# Altium schematic sheet [1]-Controller_Page.SchDoc: STM Bluepill
size A; DrawnBy: Aviral Mishra; DocumentNumber: 1; Revision: V1.0; SheetNumber: 1; SheetTotal: 2; Company Name: Esteem PCB
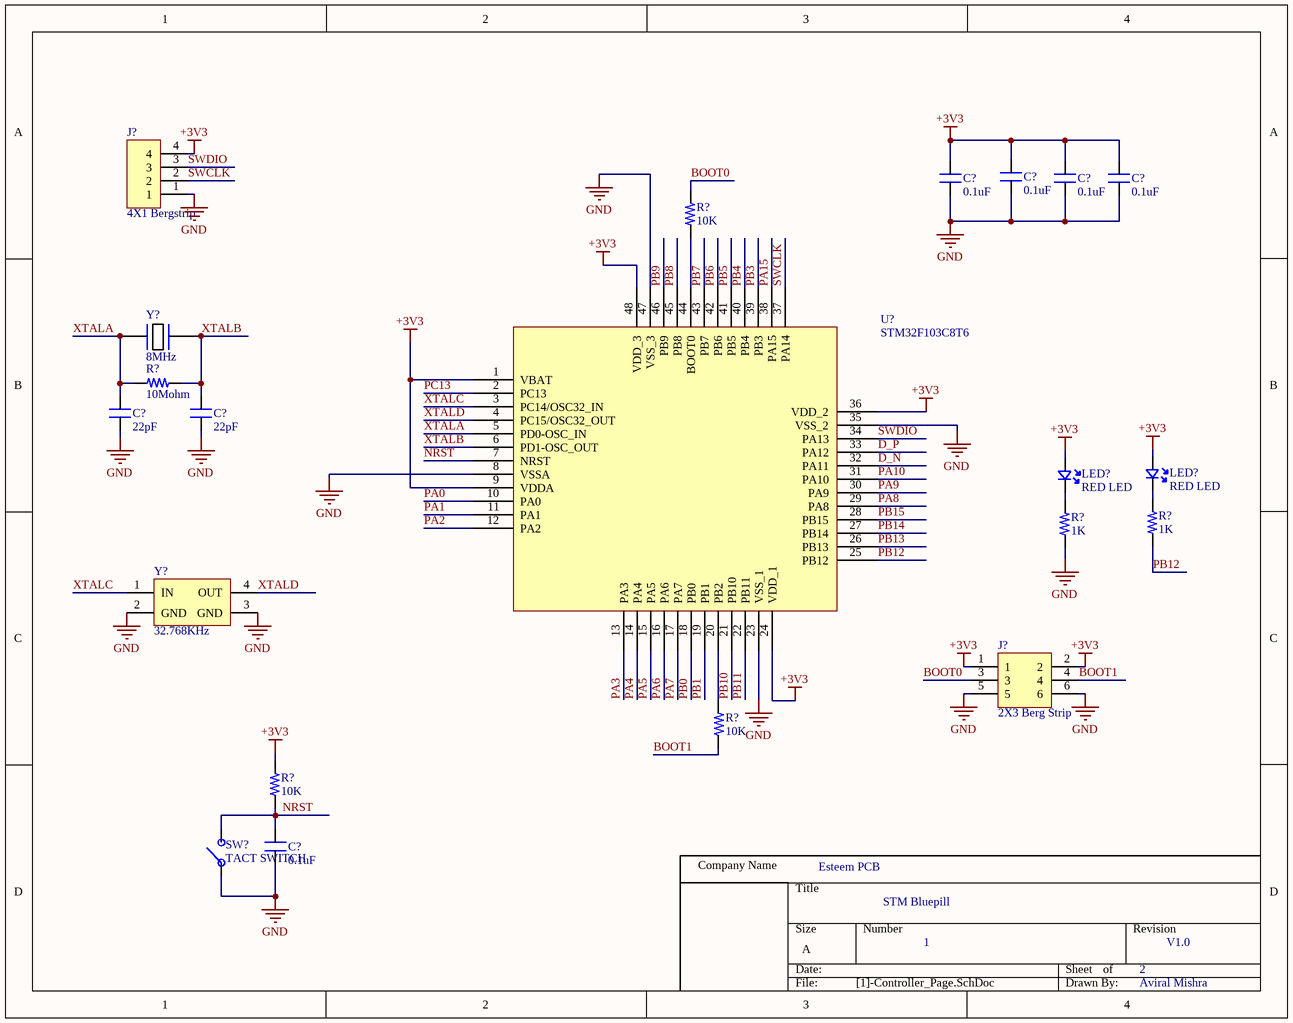
[diagram p0: [1]-Controller_Page.SchDoc]

## Parts
(Parts that share a designator on the sheet are numbered #1, #2 ... from top to bottom, then left to right.)
C?#1  0.1uF  [CAP_0805]
C?#2  0.1uF  [CAP_0805]
C?#3  0.1uF  [CAP_0805]
C?#4  0.1uF  [CAP_0805]
C?#5  22pF  [CAP_0805]
C?#6  22pF  [CAP_0805]
C?#7  0.1uF  [CAP_0805]
J?#1  4X1 Bergstrip  [CON4_100_40D72_TH_ST_MALE]
J?#2  2X3 Berg Strip  [CON6_100_59D78_TH_ST_Duplicate]
LED?#1  RED LED  [LED_0805]
LED?#2  RED LED  [LED_0805]
R?#1  10K  [RES_0805]
R?#2  10Mohm  [RES_0805]
R?#3  1K  [RES_0805]
R?#4  1K  [RES_0805]
R?#5  10K  [RES_0805]
R?#6  10K  [RES_0805]
SW?  TACT SWITCH  [SW_342_SMD]
U?  STM32F103C8T6  [LQFP-48_19.6_393_58X11_SMD]
Y?#1  8MHz  [XTAL_314_240X47_SMD]
Y?#2  32.768KHz  [XTAL_MC-405 32.7680K-G3]

## Nets
+3V3: C?#1.2 C?#2.2 C?#3.2 C?#4.2 J?#1.4 J?#2.1 J?#2.2 LED?#1.A LED?#2.A R?#6.2 U?.1(VBAT) U?.9(VDDA) U?.24(VDD_1) U?.36(VDD_2) U?.48(VDD_3)
GND: C?#1.1 C?#2.1 C?#3.1 C?#4.1 C?#5.1 C?#6.1 C?#7.1 J?#1.1 J?#2.5 J?#2.6 R?#3.1 SW?.1 U?.8(VSSA) U?.23(VSS_1) U?.35(VSS_2) U?.47(VSS_3) Y?#2.2(GND) Y?#2.3(GND)
BOOT0: J?#2.3 R?#1.2
BOOT1: J?#2.4 R?#5.2
D_N: U?.32(PA11)
D_P: U?.33(PA12)
NRST: C?#7.2 R?#6.1 SW?.2 U?.7(NRST)
PA0: U?.10(PA0)
PA1: U?.11(PA1)
PA2: U?.12(PA2)
PA3: U?.13(PA3)
PA4: U?.14(PA4)
PA5: U?.15(PA5)
PA6: U?.16(PA6)
PA7: U?.17(PA7)
PA8: U?.29(PA8)
PA9: U?.30(PA9)
PA10: U?.31(PA10)
PA15: U?.38(PA15)
PB0: U?.18(PB0)
PB1: U?.19(PB1)
PB3: U?.39(PB3)
PB4: U?.40(PB4)
PB5: U?.41(PB5)
PB6: U?.42(PB6)
PB7: U?.43(PB7)
PB8: U?.45(PB8)
PB9: U?.46(PB9)
PB10: U?.21(PB10)
PB11: U?.22(PB11)
PB12: R?#4.1 U?.25(PB12)
PB13: U?.26(PB13)
PB14: U?.27(PB14)
PB15: U?.28(PB15)
PC13: U?.2(PC13)
SWCLK: J?#1.2 U?.37(PA14)
SWDIO: J?#1.3 U?.34(PA13)
XTALA: C?#5.2 R?#2.1 U?.5(PD0-OSC_IN) Y?#1.1
XTALB: C?#6.2 R?#2.2 U?.6(PD1-OSC_OUT) Y?#1.2
XTALC: U?.3(PC14/OSC32_IN) Y?#2.1(IN)
XTALD: U?.4(PC15/OSC32_OUT) Y?#2.4(OUT)
NetLED?#1_K: LED?#1.K R?#3.2
NetLED?#2_K: LED?#2.K R?#4.2
NetR?#1_1: R?#1.1 U?.44(BOOT0)
NetR?#5_1: R?#5.1 U?.20(PB2)

## Notes on the sheet
- Company Name

## Library data of the parts
C?#1-C?#4 C?#7 = CAP_0.1uF-50V-5%-0805: 0.1µF ±5% 50V Ceramic Capacitor X7R 0805 (2012 Metric); Manufacturer: KEMET; Manufacturing Part Number: C0805C104J5RACTU; Case/Package: 0805 (2012 Metric); Supplier-1: Digikey; Supplier Part Number-1: 399-1171-1-ND
C?#5 C?#6 = CAP_22pF-50V-5%-0805: 22pF ±5% 50V Ceramic Capacitor C0G, NP0 0805 (2012 Metric); Manufacturer: KEMET; Manufacturer Part Number: C0805C220J5GACTU; Case/Package: 0805; Supplier-1: Digikey; Supplier Part Number-1: 399-1113-1-ND
J?#1 = CON-BS-PLG_4X1-100-TH-ST: 4 pin, 1 row, 2.54mm pitch bergstrip; Manufacturer: NA; Manufacturing Part Number: NA; Case/Package: TH; Supplier-1: NA; Supplier Part Number-1: NA
J?#2 = CON-BS-PLG_2X3-100-TH-ST: 6 pin, 2 row, 2.54mm pitch bergstrip; Manufacturer: NA; Manufacturer Part Number: NA; Case/Package: TH; Supplier-1: NA; Supplier Part Number-1: NA
LED?#1 LED?#2 = LED-RED_10mA-0805: Red 621nm LED Indication - Discrete 2V 0805 (2012 Metric); Manufacturer: Lite-On Inc.; Manufacturer Part Number: LTST-C170EKT; Case/ Package: 0805; Supplier-1: Digikey; Supplier Part Number-1: 160-1178-1-ND
R?#1 R?#5 R?#6 = RES_10K-0.125W-1%-0805: 10 kOhms ±1% 0.125W, 1/8W Chip Resistor 0805 (2012 Metric) Moisture Resistant Thick Film; Manufacturer: Yageo; Manufacturing Part Number: RC0805FR-0710KL; Case/Package: 0805; Supplier-1: Digikey; Supplier Part Number-1: 311-10.0KCRCT-ND
R?#2 = RES_10MOHM-0.125W-1%-0805: 10 MOhms ±1% 0.125W, 1/8W Chip Resistor 0805 (2012 Metric) Automotive AEC-Q200, High Voltage Thick Film; Manufacturer: Rohm Semiconductor; Manufacturing Part Number: KTR10EZPF1005; Case/Package: 0805 (2012 Metric); Supplier-1: Digikey; Supplier Part Number-1: RHM10.0MAHCT-ND
R?#3 R?#4 = RES_1K-0.125W-1%-0805: 1 kOhms ±1% 0.125W, 1/8W Chip Resistor 0805 (2012 Metric) Moisture Resistant Thick Film; Manufacturer: 垈㎵á; Manufacturer Part Number: RC0805FR-071KL; Case/Package: 0805; Supplier-1: Digikey; Supplier Part Number-1: 311-1.00KCRCT-ND
SW? = SW_KSR223GLFG-SMD: Tactile Switch SPST-NO Top Actuated Surface Mount; Manufacturer: C&K; Manufacturing Part Number: KSR223GLFG; Case/Package: SMD; Supplier-1: Digikey; Supplier Part Number-1: 401-1704-1-ND
U? = IC-STM32F103C8T6 _1: ARM® Cortex®-M3 STM32F1 Microcontroller IC 32-Bit 72MHz 64KB (64K x 8) FLASH /; Manufacturer: STMicroelectronics; Manufacturer Part Number: STM32F103C8T6; Case/Package: 48-LQFP; Supplier-1: Digikey; Supplier Part Number-1: 497-6063-ND
Y?#1 = XTAL_8MHZ-LFXTAL030234: Crystals 8MHz 22pF -20C 70C; Manufacturer: IQD Frequency Products; Manufacturing Part Number: LFXTAL030234Reel; Case/Package: SMD; Supplier-1: Mouser; Supplier Part Number-1: 449-LFXTAL030234REEL
Y?#2 = XTAL_32.768KHz-MC-405 32.7680K-G3: Crystals SMD AT XTL MHZ +/-50PPM 12.5 PF 250 T/R; Manufacturer: Epson; Manufacturing Part Number: MC-405 32.7680K-G3: ROHS; Case/Package: SMD; Supplier-1: Mouser; Supplier Part Number-1: 732-MC405327680KG3RS